# Altium schematic sheet output&ext-modules.SchDoc
size A4; SheetNumber: 5; SheetTotal: 5
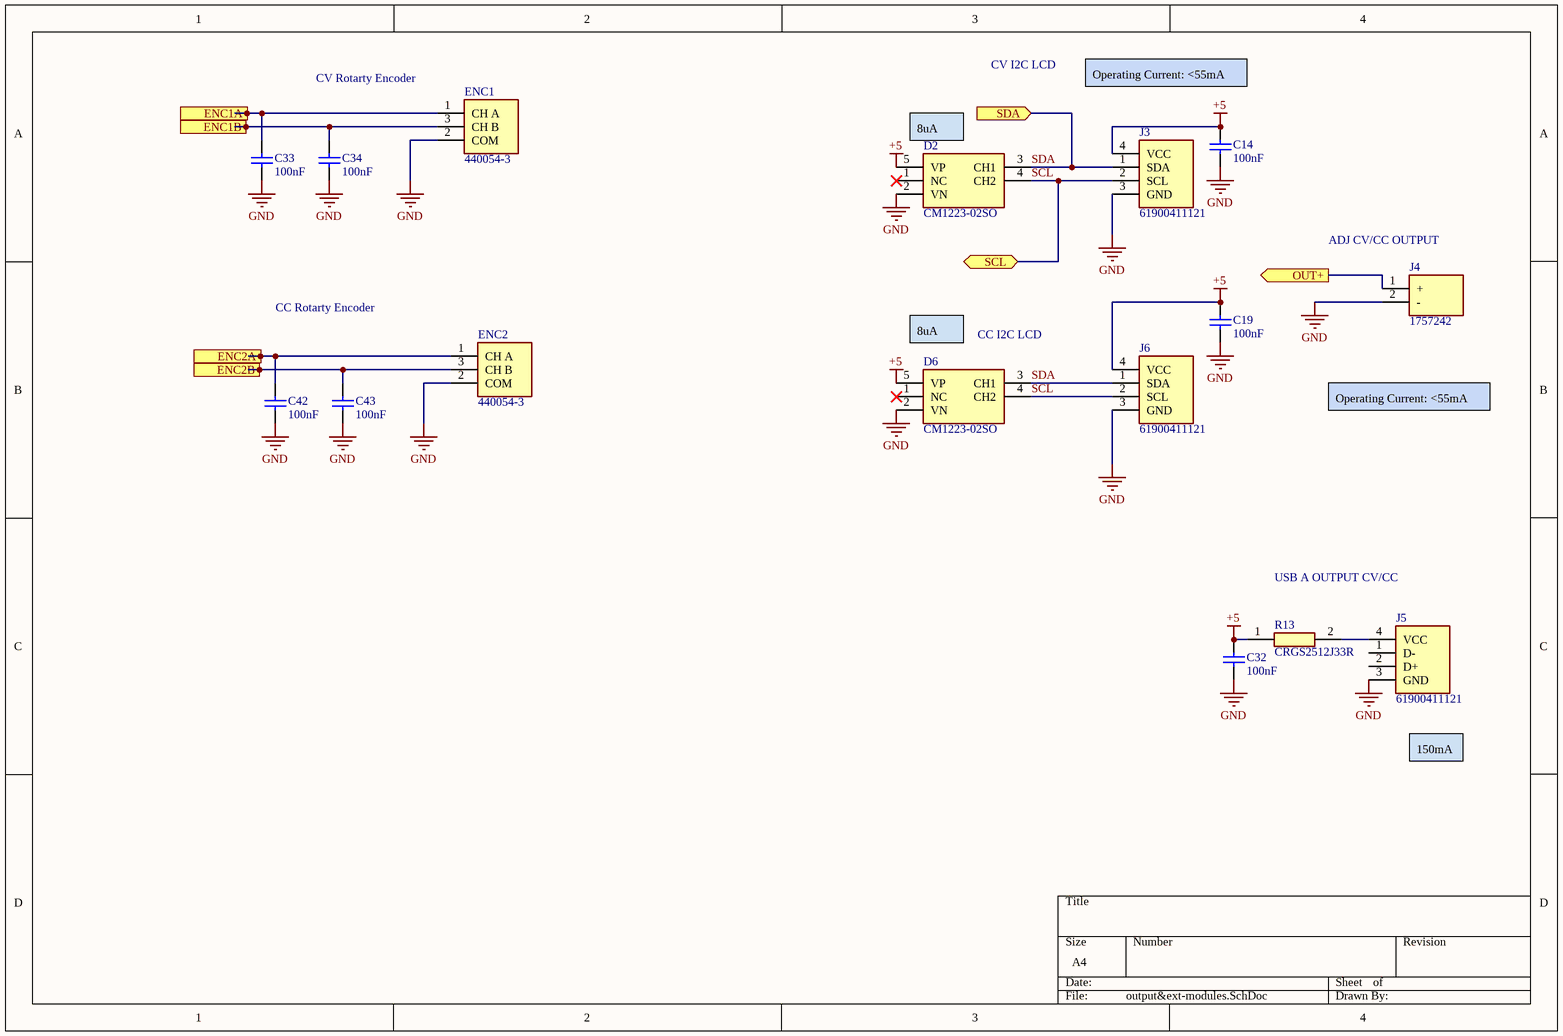
[diagram p0: output&ext-modules.SchDoc]

## Parts
C14  value 100nF  [Cap_0603]  (hidden comment: Cap)
C19  value 100nF  [Cap_0603]  (hidden comment: Cap)
C32  value 100nF  [Cap_0603]  (hidden comment: Cap)
C33  value 100nF  [Cap_0603]  (hidden comment: Cap)
C34  value 100nF  [Cap_0603]  (hidden comment: Cap)
C42  value 100nF  [Cap_0603]  (hidden comment: Cap)
C43  value 100nF  [Cap_0603]  (hidden comment: Cap)
D2  CM1223-02SO  [SOT95P280X145-5N]
D6  CM1223-02SO  [SOT95P280X145-5N]
ENC1  440054-3  [SHDR3W50P0X200_1X3_800X470X635P]
ENC2  440054-3  [SHDR3W50P0X200_1X3_800X470X635P]
J3  61900411121  [SHDR4W64P0X254_1X4_1020X580X1175P]
J4  1757242  [1757242]
J5  61900411121  [SHDR4W64P0X254_1X4_1020X580X1175P]
J6  61900411121  [SHDR4W64P0X254_1X4_1020X580X1175P]
R13  CRGS2512J33R  [RESC6432X65N]

## Ports
ENC1A (out), ENC1B (out), ENC2A (out), ENC2B (out), OUT+ (out), SCL (bidir), SDA (in)

## Nets
+5: C14.1 C19.1 C32.1 D2.5(VP) D6.5(VP) J3.4(VCC) J6.4(VCC) R13.1
GND: C14.2 C19.2 C32.2 C33.2 C34.2 C42.2 C43.2 D2.2(VN) D6.2(VN) ENC1.2(COM) ENC2.2(COM) J3.3(GND) J4.2(-) J5.3(GND) J6.3(GND)
ENC1A: C33.1 ENC1.1(CH_A) ; port ENC1A
ENC1B: C34.1 ENC1.3(CH_B) ; port ENC1B
ENC2A: C42.1 ENC2.1(CH_A) ; port ENC2A
ENC2B: C43.1 ENC2.3(CH_B) ; port ENC2B
OUT+: J4.1(+) ; port OUT+
SCL: D2.4(CH2) D6.4(CH2) J3.2(SCL) J6.2(SCL) ; port SCL
SDA: D2.3(CH1) D6.3(CH1) J3.1(SDA) J6.1(SDA) ; port SDA
NetJ5_4: J5.4(VCC) R13.2

Not connected (* = marked no-connect by the designer): D2 1(NC)*; D6 1(NC)*; J5 1(D-) 2(D+)

## Notes on the sheet
- CV Rotarty Encoder
- CV I2C LCD
- Operating Current: <55mA
- (near D2) 8uA
- (near J4) ADJ CV/CC OUTPUT
- CC Rotarty Encoder
- (near D6) 8uA
- (near D6) CC I2C LCD
- USB A OUTPUT CV/CC
- 150mA

## Library data of the parts
C14 C19 C32-C34 C42 C43 = Cap: Capacitor; Published: 8-Jun-2000; LatestRevisionDate: 17-Jul-2002; LatestRevisionNote: Re-released for DXP Platform.; PackageReference: RAD-0.3; Publisher: Altium Limited; PackageDescription: Radial Cap, Thru-Hole; 2 Leads; 0.3 in Pin Spacing
D2 D6 = CM1223-02SO: TVS Diode (Uni-directional); Manufacturer_Name: onsemi; Datasheet Link: https://www.onsemi.com/pdf/datasheet/cm1223-d.pdf; Height: 1.45mm; Manufacturer_Part_Number: CM1223-02SO; Mouser Part Number: 748-CM1223-02SO; Mouser Price/Stock: https://www.mouser.co.uk/ProductDetail/onsemi/CM1223-02SO?qs=lLuKAerq7nnvVg3rEtIojA%3D%3D; ComponentLink1Description: Datasheet; ComponentLink1URL: https://www.onsemi.com/pdf/datasheet/cm1223-d.pdf
ENC1 ENC2 = 440054-3: Connector; Manufacturer_Name: TE Connectivity; Datasheet Link: https://www.te.com/commerce/DocumentDelivery/DDEController?Action=srchrtrv&DocNm=440054&DocType=Customer+Drawing&DocLang=English&DocFormat=pdf&PartCntxt=440054-3; Height: 6.35mm; Manufacturer_Part_Number: 440054-3; Mouser Part Number: 571-440054-3; Mouser Price/Stock: https://www.mouser.co.uk/ProductDetail/TE-Connectivity/440054-3?qs=JFPmFzpscO5ATC%252BmN3ka1Q%3D%3D; Arrow Part Number: 440054-3; Arrow Price/Stock: https://www.arrow.com/en/products/440054-3/te-connectivity?region=nac; ComponentLink1Description: Encoder Datasheet; ComponentLink1URL: https://www.farnell.com/datasheets/3750970.pdf
J3 J5 J6 = 61900411121: Connector; Manufacturer_Name: Wurth Elektronik; Datasheet Link: https://katalog.we-online.de/em/datasheet/6190xx11121.pdf; Height: 11.75mm; Manufacturer_Part_Number: 61900411121; Mouser Part Number: 710-61900411121; Mouser Price/Stock: https://www.mouser.co.uk/ProductDetail/Wurth-Elektronik/61900411121?qs=W%252B2sBeLta1Z79%252BA04MeSCQ%3D%3D
  J3 J6: ComponentLink1Description: LCD Datasheet; ComponentLink1URL: https://www.farnell.com/datasheets/3708797.pdf
  J5: ComponentLink1Description: USB A; ComponentLink1URL: https://www.te.com/usa-en/product-1932258-1.datasheet.pdf
J4 = 1757242: Connector; Manufacturer_Name: Phoenix Contact; Datasheet Link: http://www.phoenixcontact.com/de/produkte/1757242/pdf; Height: 8.72mm; Manufacturer_Part_Number: 1757242; Mouser Part Number: 651-1757242; Mouser Price/Stock: https://www.mouser.co.uk/ProductDetail/Phoenix-Contact/1757242?qs=uD%2FdkN7XIa3Ejiz9qDxlzw%3D%3D; Arrow Part Number: 1757242; Arrow Price/Stock: https://www.arrow.com/en/products/1757242/phoenix-contact?region=nac; ComponentLink1Description: Datasheet; ComponentLink1URL: http://www.phoenixcontact.com/de/produkte/1757242/pdf
R13 = CRGS2512J33R: SMD Chip Resistor, 33 ohm, ± 5%, 1.5 W, 2512 [6432 Metric], Thick Film, Anti-Surge; Manufacturer_Name: TE Connectivity; Datasheet Link: http://www.te.com/commerce/DocumentDelivery/DDEController?Action=showdoc&DocId=Data+Sheet%7F9-1773463-8%7FB%7Fpdf%7FEnglish%7FENG_DS_9-1773463-8_B.pdf%7F3-2176251-0; Height: 0.65mm; Manufacturer_Part_Number: CRGS2512J33R; ComponentLink1Description: Datasheet; ComponentLink1URL: https://www.farnell.com/datasheets/2027916.pdf